# EAGLE design sensor_node_v2 (EAGLE 7.2.0)
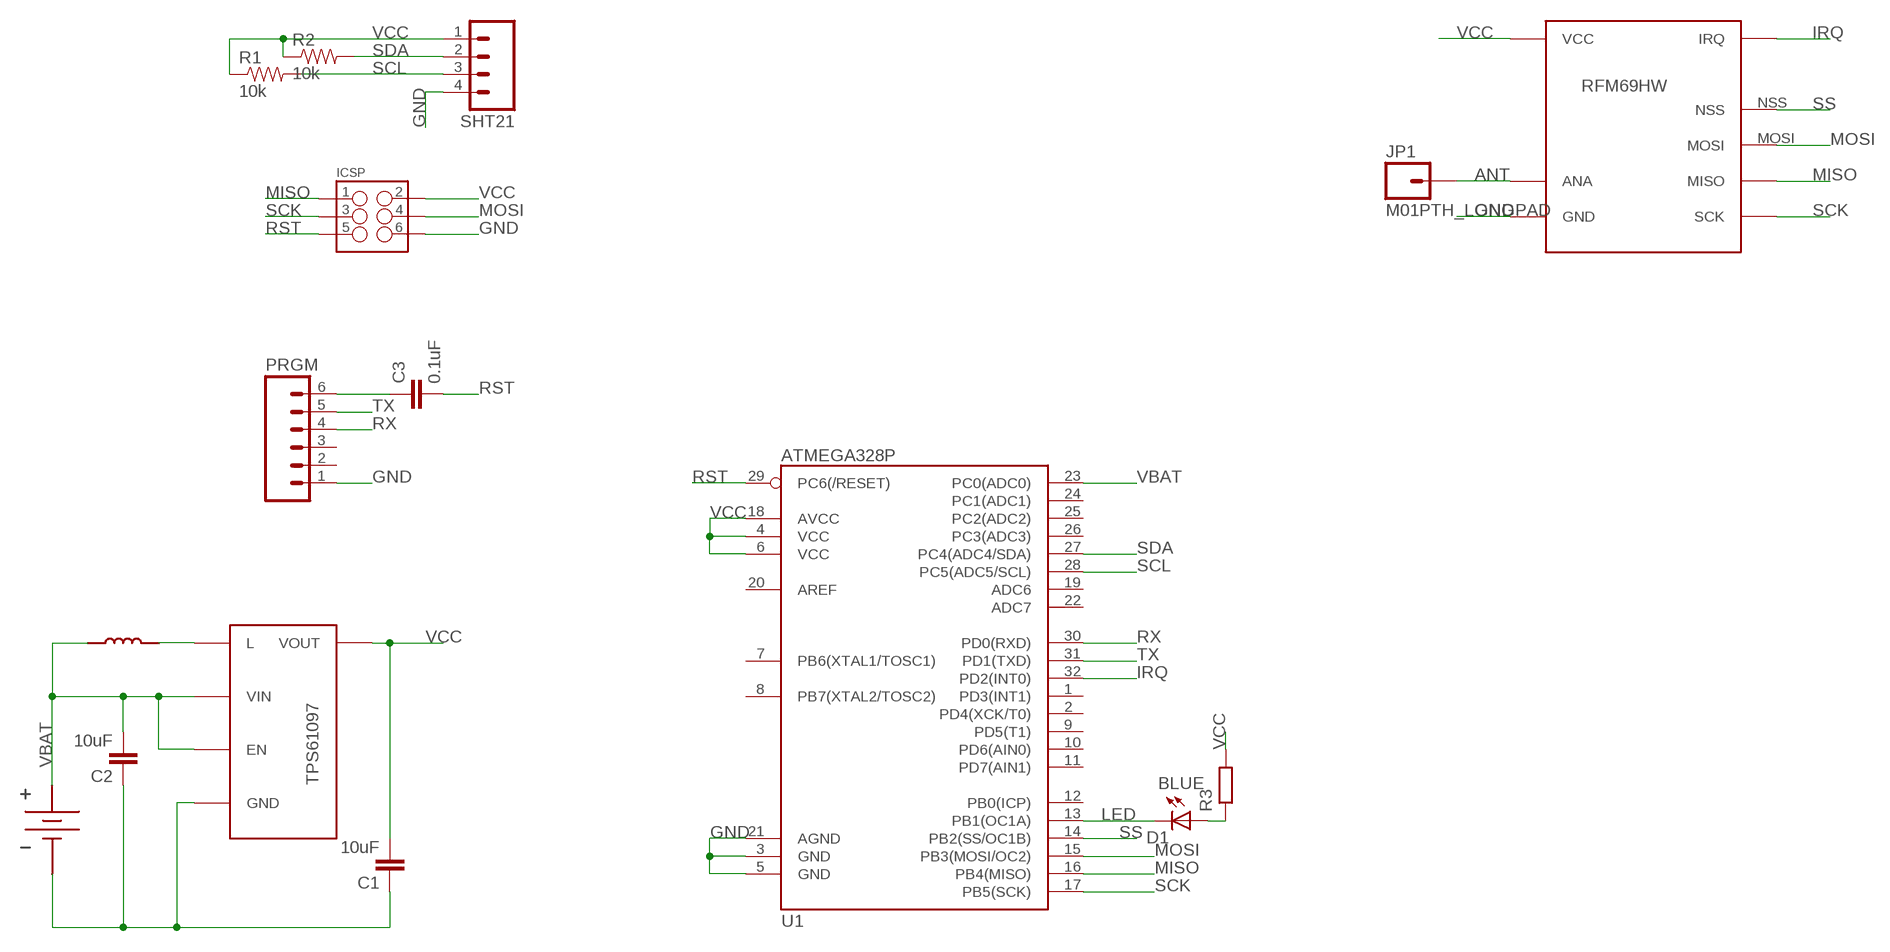
[diagram p0: schematic, sheet 1]

## Parts
C1  10uF  10UF-6.3V-20%(0603)  [0603-CAP]
C2  10uF  10UF-6.3V-20%(0603)  [0603-CAP]
C3  0.1uF  0.22UF50V-20%,+80%(0603)  [0603-CAP]
D1  BLUE  LED-BLUE0603  [LED-0603]
ICSP  M03X2FEMALE_SMD  [2X3_SMD]
JP1  M01PTH_LONGPAD  [1X01_LONGPAD]
PRGM  M06LOCK_LONGPADS  [1X06_LOCK_LONGPADS]
R1  10k  2.0KOHM1/10W5%(0603)  [0603-RES]
R2  10k  2.0KOHM1/10W5%(0603)  [0603-RES]
R3  RESISTOR0603-N  [R0603-N]
SHT21  M04LOCK_LONGPADS  [1X04_LOCK_LONGPADS]
U1  ATMEGA328P  ATMEGA328_SMT  [TQFP32-08]
U$1  KEYSTONEAAHOLDER_2CELL  [KEYSTONEAAHOLDER_2CELL]
U$2  TPS61097-33  [SOT23-5]
U$3  COILCRAFT_DO3314  [COILCRAFT_DO3314]
U$4  RFM69HW_MIN  [RFM69]

## Nets
ANT: JP1.1 U$4.ANA
GND: C1.1 C2.1 ICSP.6 PRGM.1 SHT21.4 U1.3(GND) U1.5(GND) U1.21(AGND) U$1.P$2(GND) U$2.P$2(GND) U$4.GND
IRQ: U1.32(PD2(INT0)) U$4.DIO0(IRQ)
LED: D1.C U1.13(PB1(OC1A))
MISO: ICSP.1 U1.16(PB4(MISO)) U$4.MISO
MOSI: ICSP.4 U1.15(PB3(MOSI/OC2)) U$4.MOSI
N$1: U$2.P$5(L) U$3.P$1
N$2: C3.1 PRGM.6
N$3: D1.A R3.1
RST: C3.2 ICSP.5 U1.29(PC6(/RESET))
RX: PRGM.4 U1.30(PD0(RXD))
SCK: ICSP.3 U1.17(PB5(SCK)) U$4.SCK
SCL: R1.2 SHT21.3 U1.28(PC5(ADC5/SCL))
SDA: R2.2 SHT21.2 U1.27(PC4(ADC4/SDA))
SS: U1.14(PB2(SS/OC1B)) U$4.NSS
TX: PRGM.5 U1.31(PD1(TXD))
VBAT: C2.2 U1.23(PC0(ADC0)) U$1.P$1(VBAT) U$2.P$1(VIN) U$2.P$3(EN) U$3.P$2
VCC: C1.2 ICSP.2 R1.1 R2.1 R3.2 SHT21.1 U1.4(VCC) U1.6(VCC) U1.18(AVCC) U$2.P$4(VOUT) U$4.VCC
Unconnected: PRGM.2 PRGM.3 U1.1(PD3(INT1)) U1.2(PD4(XCK/T0)) U1.7(PB6(XTAL1/TOSC1)) U1.8(PB7(XTAL2/TOSC2)) U1.9(PD5(T1)) U1.10(PD6(AIN0)) U1.11(PD7(AIN1)) U1.12(PB0(ICP)) U1.19(ADC6) U1.20(AREF) U1.22(ADC7) U1.24(PC1(ADC1)) U1.25(PC2(ADC2)) U1.26(PC3(ADC3))

## Library data of the parts
C1 C2 = SparkFun-Capacitors:10UF-6.3V-20%(0603): CAP-11015; PROD_ID: CAP-11015
C3 = SparkFun-Capacitors:0.22UF50V-20%,+80%(0603): CAP-09885; PROD_ID: CAP-09885; VALUE: 0.22uF
D1 = SparkFun-LED:LED-BLUE: Blue LEDs for production use Various blue LEDs stocked by SparkFun production 0603 - DIO-08575 Rebel - DIO-09553 1206 - DIO-09911; PROD_ID: DIO-08575
ICSP = SparkFun-Connectors:M03X2: 2x3 .1" header. Shrouded, with keying- CONN-10681 SMT- CONN-11415 Pogo pins- HW-11044; PROD_ID: CONN-11290
JP1 = SparkFun-Connectors:M01: Header 1 Standard 1-pin 0.1" header. Use with straight break away headers (SKU : PRT-00116), right angle break away headers (PRT-00553), swiss pins (PRT-00743), machine pins (PRT-00117), and female headers (PRT-00115).
PRGM = SparkFun-Connectors:M06: Header 6 Standard 6-pin 0.1" header. Use with straight break away headers (SKU : PRT-00116), right angle break away headers (PRT-00553), swiss pins (PRT-00743), machine pins (PRT-00117), and female headers (PRT-00115). Molex polarized connector foot print use with SKU : PRT-08094 with associated crimp pins and housings. NOTES ON THE VARIANTS LOCK and LOCK_LONGPADS... This footprint was designed to help hold the alignment of a through-hole component (i.e. 6-pin header) while soldering it into place. You may notice that each hole has been shifted either up or down by 0.005 of an inch from it's more standard position (which is a perfectly straight line). This slight alteration caused the pins (the squares in the middle) to touch the edges of the holes. Because they are alternating, it causes a "brace" to hold the component in place. 0.005 has proven to be the perfect amount of "off-center" position when using our standard breakaway headers. Although looks a little odd when you look at the bare footprint, once you have a header in there, the alteration is very hard to notice. Also,if you push a header all the way into place, it is covered up entirely on the bottom side. This idea of altering the position of holes to aid alignment will be further integrated into the Sparkfun Library for other footprints. It can help hold any component with 3 or more connection pins.
R1 R2 = SparkFun-Resistors:2.0KOHM1/10W5%(0603): RES-08296; PROD_ID: RES-08296; VALUE: 2.0k
R3 = passives-7351:RESISTOR
SHT21 = SparkFun-Connectors:M04: Header 4 Standard 4-pin 0.1" header. Use with straight break away headers (SKU : PRT-00116), right angle break away headers (PRT-00553), swiss pins (PRT-00743), machine pins (PRT-00117), and female headers (PRT-00115). Molex polarized connector foot print use with SKU : PRT-08231 with associated crimp pins and housings. 1MM SMD Version SKU: PRT-10208
U1 = SparkFun-DigitalIC:ATMEGA328_SMT: 32-Pin Atmega328 part Commonly used on Arduino compatible boards Available in QFP and QFN packages TQFP is IC-09069 QFN is non-stock; PROD_ID: IC-09069
U$1 = myRandomThings:KEYSTONEAAHOLDER_2CELL
U$2 = myRandomThings:TPS61097-33
U$3 = myRandomThings:COILCRAFT_DO3314
U$4 = hoperf:RFM69HW_MIN

## Board
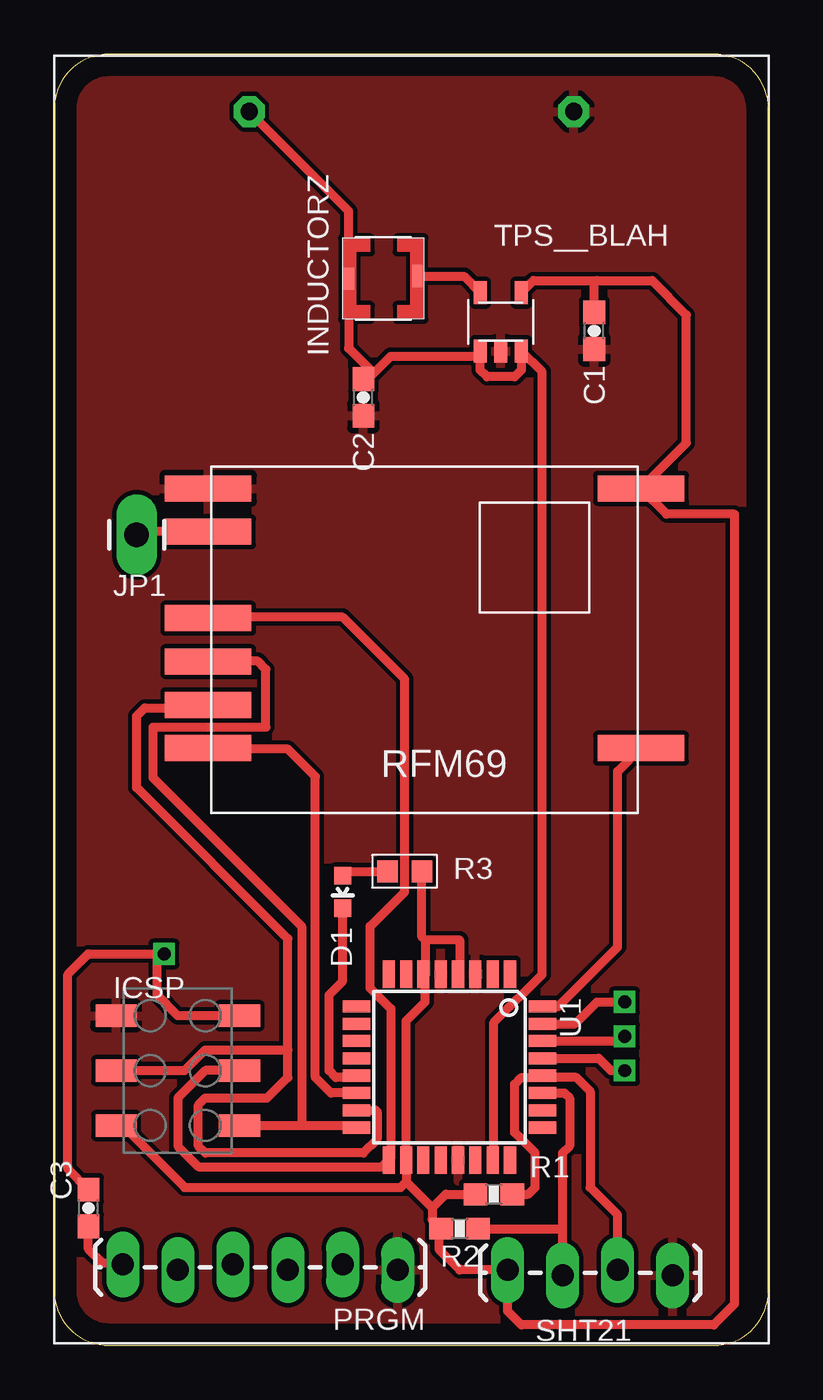
[diagram p1: board, top side]
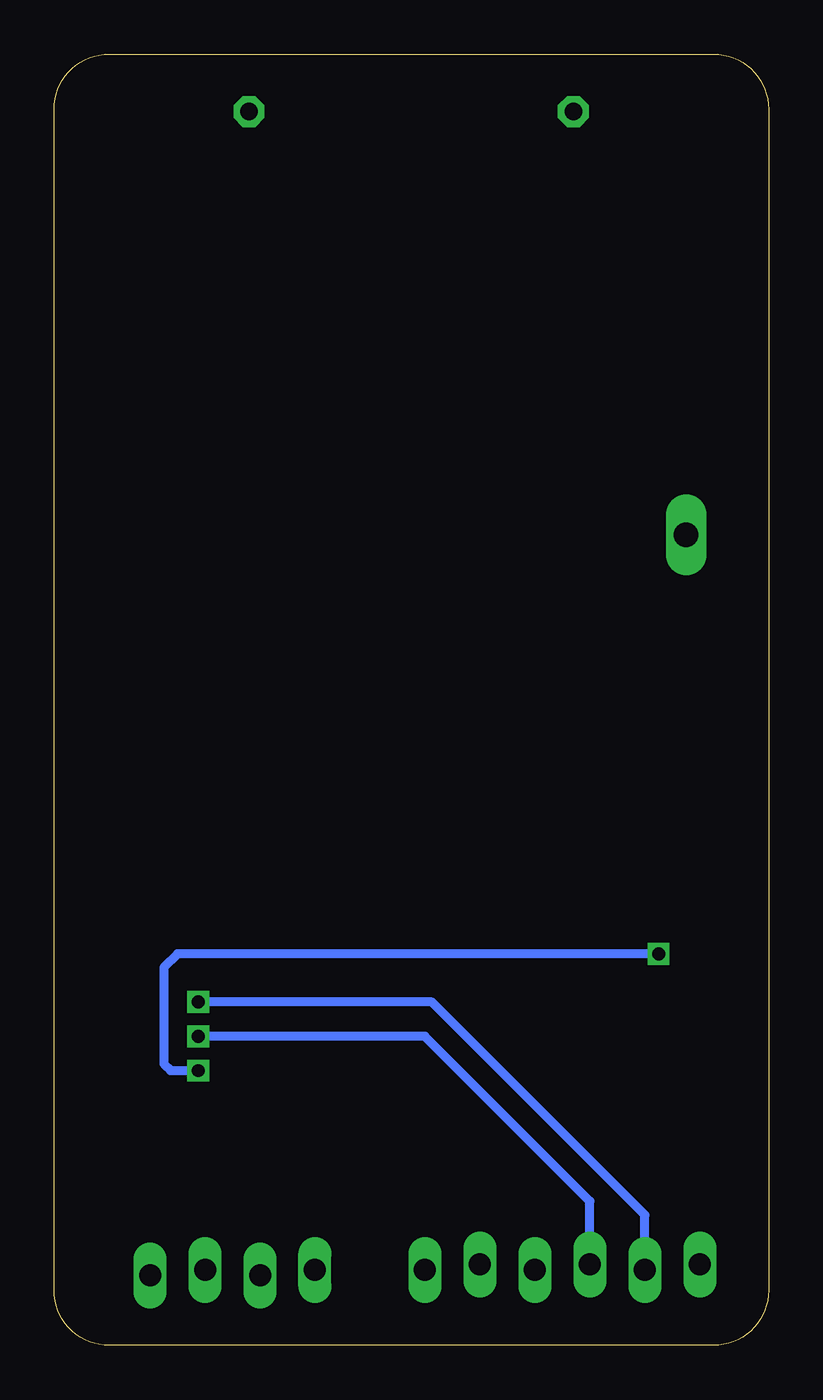
[diagram p2: board, bottom side, seen from below]

Size 33.01 x 59.68 mm. Coordinates in mm from the lower left corner, seen from the top.
Outline: 2.54,0 30.47,0 arc90 33.01,2.54 33.01,57.14 arc90 30.47,59.68 2.54,59.68 arc90 0,57.14 0,2.54 arc90 2.54,0
Copper layers (1*16): Top 0.035mm / dielectric 1.5mm / Bottom 0.035mm
Design rules "default": minimum track width 10mil, minimum drill 24mil, track to track 8mil, track to pad 8mil, pad to pad 8mil, via to via 8mil, smd to smd 8mil, copper to edge 40mil, drill to drill 8mil, minimum pad ring 10mil, minimum via ring 8mil, stop-mask expansion 4mil, vias tented up to drill 0mil, thermal gap 10mil

### Footprints (pad centres in the part's own frame; a part is rotated, then mirrored left to right if it is on the bottom)
0603-CAP = smd 1.1 x 1: 1 -0.85,0; 2 0.85,0
LED-0603 = smd 0.8 x 0.8: A 0,-0.75; C 0,0.75
2X3_SMD = smd 1.02 x 1.9: 1 -2.54,-2.85; 2 -2.54,2.85; 3 0,-2.85; 4 0,2.85; 5 2.54,-2.85; 6 2.54,2.85
1X01_LONGPAD = drill 1.118 pad 1.88 long: 1 0,0
1X06_LOCK_LONGPADS = drill 1.016 long: 1 0,0; 2 2.54,-0.254; 3 5.08,0; 4 7.62,-0.254; 5 10.16,0; 6 12.7,-0.254
0603-RES = smd 1.1 x 1: 1 -0.85,0; 2 0.85,0
R0603-N = smd 0.95 x 1: 1 -0.8,0; 2 0.8,0
1X04_LOCK_LONGPADS = drill 1.016 long: 1 0,0; 2 2.54,-0.254; 3 5.08,0; 4 7.62,-0.254
TQFP32-08 = smd 1.27 x 0.559: 1 -4.293,2.8; 2 -4.293,2; 3 -4.293,1.2; 4 -4.293,0.4; 5 -4.293,-0.4; 6 -4.293,-1.2; 7 -4.293,-2; 8 -4.293,-2.8; 17 4.293,-2.8; 18 4.293,-2; 19 4.293,-1.2; 20 4.293,-0.4; 21 4.293,0.4; 22 4.293,1.2; 23 4.293,2; 24 4.293,2.8 | smd 0.559 x 1.27: 9 -2.8,-4.293; 10 -2,-4.293; 11 -1.2,-4.293; 12 -0.4,-4.293; 13 0.4,-4.293; 14 1.2,-4.293; 15 2,-4.293; 16 2.8,-4.293; 25 2.8,4.293; 26 2,4.293; 27 1.2,4.293; 28 0.4,4.293; 29 -0.4,4.293; 30 -1.2,4.293; 31 -2,4.293; 32 -2.8,4.293
KEYSTONEAAHOLDER_2CELL = drill 0.8 pad 1.422 octagon: P$1 -7.493,27.178; P$2 7.493,27.178
SOT23-5 = smd 0.6 x 1.05: P$1 -0.95,-1.35; P$2 0,-1.35; P$3 0.95,-1.35; P$4 0.95,1.35; P$5 -0.95,1.35
COILCRAFT_DO3314 = smd 0.508 x 1.016: P$1 -1.6,-0.1; P$2 1.6,0
RFM69 = smd 4 x 1.2: ANA 10,-5; DIO0 -10,5; GND 10,-7; MISO 10,1; MOSI 10,3; NSS 10,5; SCK 10,-1; VCC -10,-7

### Placement (x,y rotation side)
C1  24.96,46.89 90 top
C2  14.29,43.81 90 top
C3  1.59,6.35 90 top
D1  13.34,20.95 180 top
ICSP  5.71,12.7 90 top
JP1  3.81,37.47 180 top
PRGM  15.88,3.49 180 top
R1  20.32,6.99 0 top
R2  18.73,5.4 0 top
R3  16.19,21.91 0 top
SHT21  20.95,3.49 0 top
U1  18.26,12.87 270 top
U$1  16.51,29.84 0 top
U$2  20.64,47.31 0 top
U$3  15.21,49.31 180 top
U$4  17.11,32.61 180 top

### Tracks (layer width: path | path; a pad name or v marks a point on that pad's centre or on a via)
ANT
  Top 0.406: U$4.ANA 3.95,37.61 JP1.1
GND
  pour Top: 0,-0.32 33.02,-0.32 33.02,59.69 0,59.69
IRQ
  Top 0.406: U1.32 23.29,15.67 26.04,18.41 26.04,26.53 U$4.DIO0
LED
  Top 0.406: U1.13 13.88,12.38 13.02,12.38 12.7,12.7 12.7,16.19 13.34,16.83 D1.C
MISO
  Top 0.406: 11.43,10.16 ICSP.1 10.16,10.16 | 11.43,10.16 13.97,10.16 U1.16 | 11.43,10.16 11.43,19.37 4.57,26.23 4.57,28.57 9.78,28.57 9.78,31.24 9.4,31.62 7.13,31.62 U$4.MISO
MOSI
  Top 0.406: U1.15 14.85,10.87 14.92,10.79 14.92,9.53 14.29,8.89 6.99,8.89 6.67,9.21 6.67,11.11 6.99,11.43 9.84,11.43 10.79,12.38 10.79,13.65 | 10.79,13.65 10.79,18.8 3.81,25.78 3.81,29.08 4.19,29.46 6.97,29.46 U$4.MOSI | ICSP.4 6.03,12.7 6.99,13.65 10.79,13.65
N$1
  Top 0.406: U$3.P$1 18.94,49.41 U$2.P$5
N$2
  Top 0.406: C3.1 1.59,4.45 2.22,3.81 3.11,3.81 PRGM.6
N$3
  Top 0.406: D1.A 13.54,21.91 R3.1
RST  (via drill 0.6)
  Top 0.406: U1.29 25.15,13.27 25.72,12.7 v26.35,12.7 | ICSP.5 5.71,15.24 4.76,16.19 4.76,17.78 v5.08,18.1 1.59,18.1 0.64,17.14 0.64,8.15 C3.2
  Bottom 0.406: v5.08,18.1 27.3,18.1 27.94,17.46 27.94,13.02 27.62,12.7 v26.35,12.7
RX  (via drill 0.6)
  Top 0.406: U1.30 26.13,14.07 v26.35,14.29
  Bottom 0.406: PRGM.4 8.26,6.67 15.88,14.29 v26.35,14.29
SCK
  Top 0.406: ICSP.3 6.99,12.7 5.71,11.43 5.71,9.21 6.67,8.26 15.14,8.26 U1.17 15.56,8.67 15.56,15.56 14.61,16.51 14.61,19.37 16.19,20.95 16.19,30.8 13.34,33.66 7.16,33.66 U$4.SCK
SCL
  Top 0.406: SHT21.3 26.04,6.03 24.77,7.3 24.77,11.75 24.13,12.38 22.64,12.38 U1.28 22.47,12.38 21.59,12.38 21.27,12.06 21.27,9.84 22.23,8.89 22.23,7.3 21.91,6.99 R1.2
SDA
  Top 0.406: SHT21.2 23.5,5.4 | 23.5,5.4 23.5,8.89 23.81,9.21 23.81,11.43 23.58,11.67 U1.27 | R2.2 23.5,5.4
SS
  Top 0.406: U1.14 12.78,11.67 12.06,12.38 12.06,26.29 10.79,27.56 7.16,27.56 U$4.NSS
TX  (via drill 0.6)
  Top 0.406: U1.31 24.07,14.87 25.08,15.88 v26.35,15.88
  Bottom 0.406: PRGM.5 5.71,6.03 15.56,15.88 v26.35,15.88
VBAT
  Top 0.406: C2.2 14.5,44.66 14.76,44.93 | 14.76,44.93 15.56,45.72 19.45,45.72 U$2.P$1 19.68,45.09 20,44.77 21.27,44.77 21.59,45.08 U$2.P$3 22.54,45 22.54,17.14 20.32,14.92 20.32,8.63 U1.23 | 14.76,44.93 13.61,46.08 U$3.P$2 13.61,52.43 U$1.P$1
VCC
  Top 0.406: 17.14,17.07 17.14,15.88 16.26,14.99 U1.18 16.26,7.55 | 17.14,17.07 U1.6 17.14,17.24 | 17.14,18.73 17.14,17.24 | 21.67,48.66 U$2.P$4 22.14,49.21 25.08,49.21 | 25.08,49.21 27.62,49.21 29.21,47.62 29.21,41.7 U$4.VCC 28.3,38.42 31.43,38.42 31.43,1.91 30.48,0.95 21.59,0.95 20.95,1.59 SHT21.1 18.73,3.49 17.78,4.45 17.78,5.18 R2.1 17.46,5.82 17.46,6.35 | C1.2 24.96,49.09 25.08,49.21 | 17.14,17.24 17.14,17.07 | 18.73,17.23 18.73,18.73 17.14,18.73 | 18.73,17.23 U1.4 18.73,17.09 18.73,17.23 | 16.26,7.55 17.46,6.35 | ICSP.2 3.17,10.16 6.03,7.3 16.01,7.3 16.26,7.55 | 17.14,18.73 16.99,18.89 R3.2 | 17.46,6.35 18.1,6.99 R1.1

### Text on the board
tNames: TPS__BLAH | INDUCTORZ